# EAGLE design L293D_Driver (EAGLE 9.6.2)
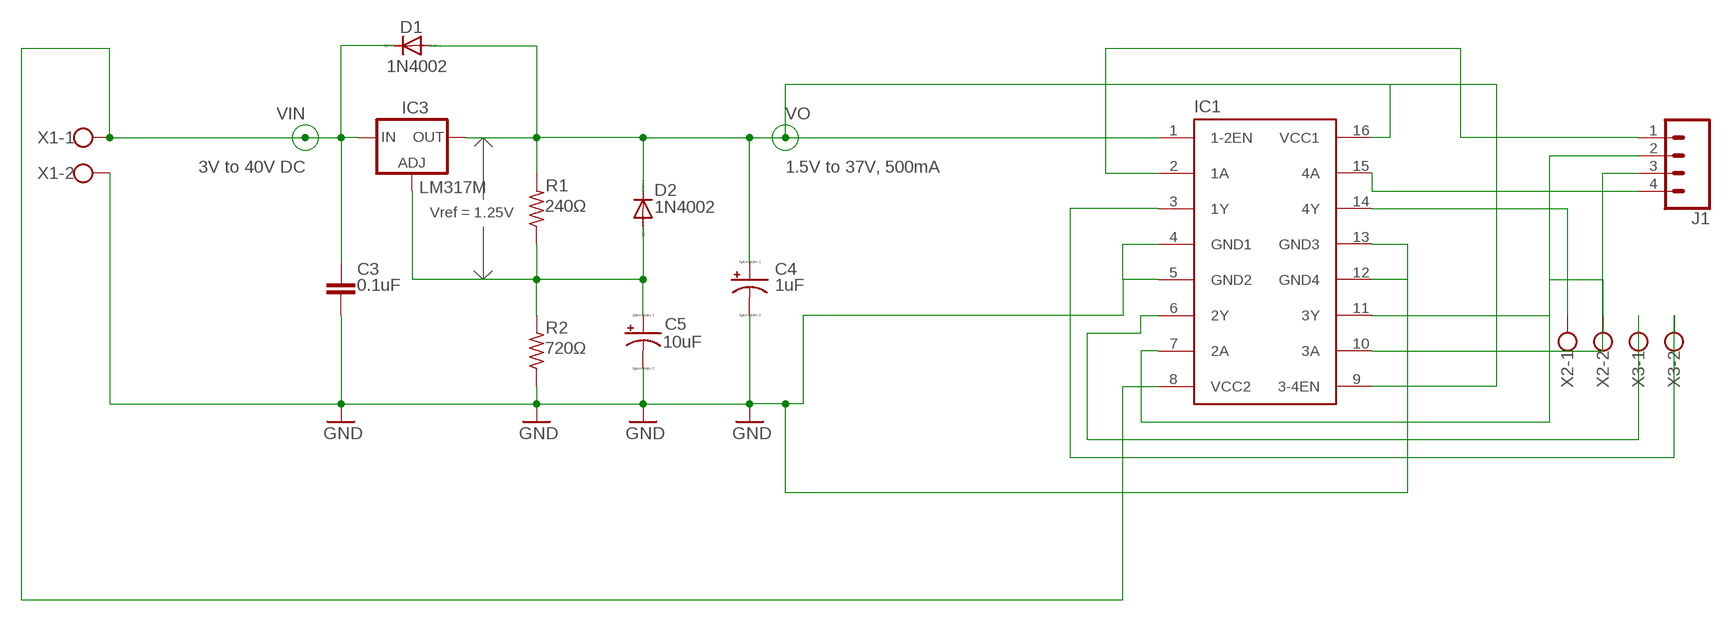
[diagram p0: schematic, sheet 1]

## Parts
C3  0.1uF  C-EU075-052X106  [C075-052X106]
C4  1uF  CPOL-US085CS-1AR  [085CS_1AR]
C5  10uF  CPOL-US085CS-1AR  [085CS_1AR]
D1  1N4002  1N4004  [DO41-10]
D2  1N4002  1N4004  [DO41-10]
IC1  L293D  [DIL16]
IC3  LM317MBSTT3  [SOT223]
J1  CONN_04PTH  [1X04]
R1  240Ω  R-US_M0805  [M0805]
R2  720Ω  R-US_M0805  [M0805]
X1  W237-102  [W237-102]
X2  W237-102  [W237-102]
X3  W237-102  [W237-102]

## Nets
GND: C3.2 C4.- C5.- IC1.4(GND1) IC1.5(GND2) IC1.12(GND4) IC1.13(GND3) R2.1 X1.2
N$1: C5.+ D2.A IC3.1(ADJ) R1.1 R2.2
N$2: IC1.15(4A) J1.4
N$3: IC1.10(3A) J1.3
N$4: IC1.14(4Y) X2.1
N$5: IC1.11(3Y) X2.2
N$6: IC1.3(1Y) X3.2
N$7: IC1.6(2Y) X3.1
N$8: IC1.7(2A) J1.2
N$9: IC1.2(1A) J1.1
VIN: C3.1 D1.C IC1.8(VCC2) IC3.3(IN) X1.1
VO: C4.+ D1.A D2.C IC1.1(1-2EN) IC1.9(3-4EN) IC1.16(VCC1) IC3.4(OUT) R1.2

## Notes on the sheet
- 3V to 40V DC | 1.5V to 37V, 500mA
- Vref = 1.25V

## Library data of the parts
C3 = rcl:C-EU: CAPACITOR, European symbol
C4 C5 = resistor:CPOL-US: POLARIZED CAPACITOR, American symbol
D1 D2 = diode:1N4004: DIODE general purpose rectifier, 1 A
IC1 = st-microelectronics:L293D: PUSH-PULL 4 CHANNEL DRIVER; MPN: L293D; OC_FARNELL: 9589619; OC_NEWARK: 56P8249
IC3 = v-reg:LM317?*: 500 mA Adjustable Output Positive Voltage Regulator Source: http://www.onsemi.co.jp .. LM317M-D.PDF; PARTNUMBER: LM317M
J1 = SparkFun-Connectors:CONN_04: Multi connection point. Often used as Generic Header-pin footprint for 0.1 inch spaced/style header connections On any of the 0.1 inch spaced packages, you can populate with these: Break Away Headers - Straight <https://www.sparkfun.com/products/116> (PRT-00116) Break Away Male Headers - Right Angle <https://www.sparkfun.com/products/553> (PRT-00553) Female Headers <https://www.sparkfun.com/products/115> (PRT-00115) Break Away Headers - Machine Pin <https://www.sparkfun.com/products/117> (PRT-00117) Break Away Female Headers - Swiss Machine Pin <https://www.sparkfun.com/products/743> (PRT-00743) For SCREWTERMINALS and SPRING TERMINALS visit here: Screw Terimnals on SparkFun.com <https://www.sparkfun.com/search/results?term=Screw+Terminals> (5mm/3.5mm/2.54mm spacing) This device is also useful as a general connection point to wire up your design to another part of your project. Our various solder wires solder well into these plated through hole pads. Hook-Up Wire - Assortment (Stranded, 22 AWG) <https://www.sparkfun.com/products/11375> (PRT-11375) Hook-Up Wire - Assortment (Solid Core, 22 AWG) <https://www.sparkfun.com/products/11367> (PRT-11367) View the entire wire category on our website here <https://www.sparkfun.com/categories/141> Special notes: Molex polarized connector foot print use with SKU : PRT-08231 with associated crimp pins and housings. 1MM SMD Version SKU: PRT-10208; PROD_ID: CONN-09696
R1 R2 = resistor:R-US_: RESISTOR, American symbol
X1-X3 = con-wago-500:W237-102: WAGO SCREW CLAMP; MPN: 237-102; OC_FARNELL: unknown; OC_NEWARK: 70K9898

## Board
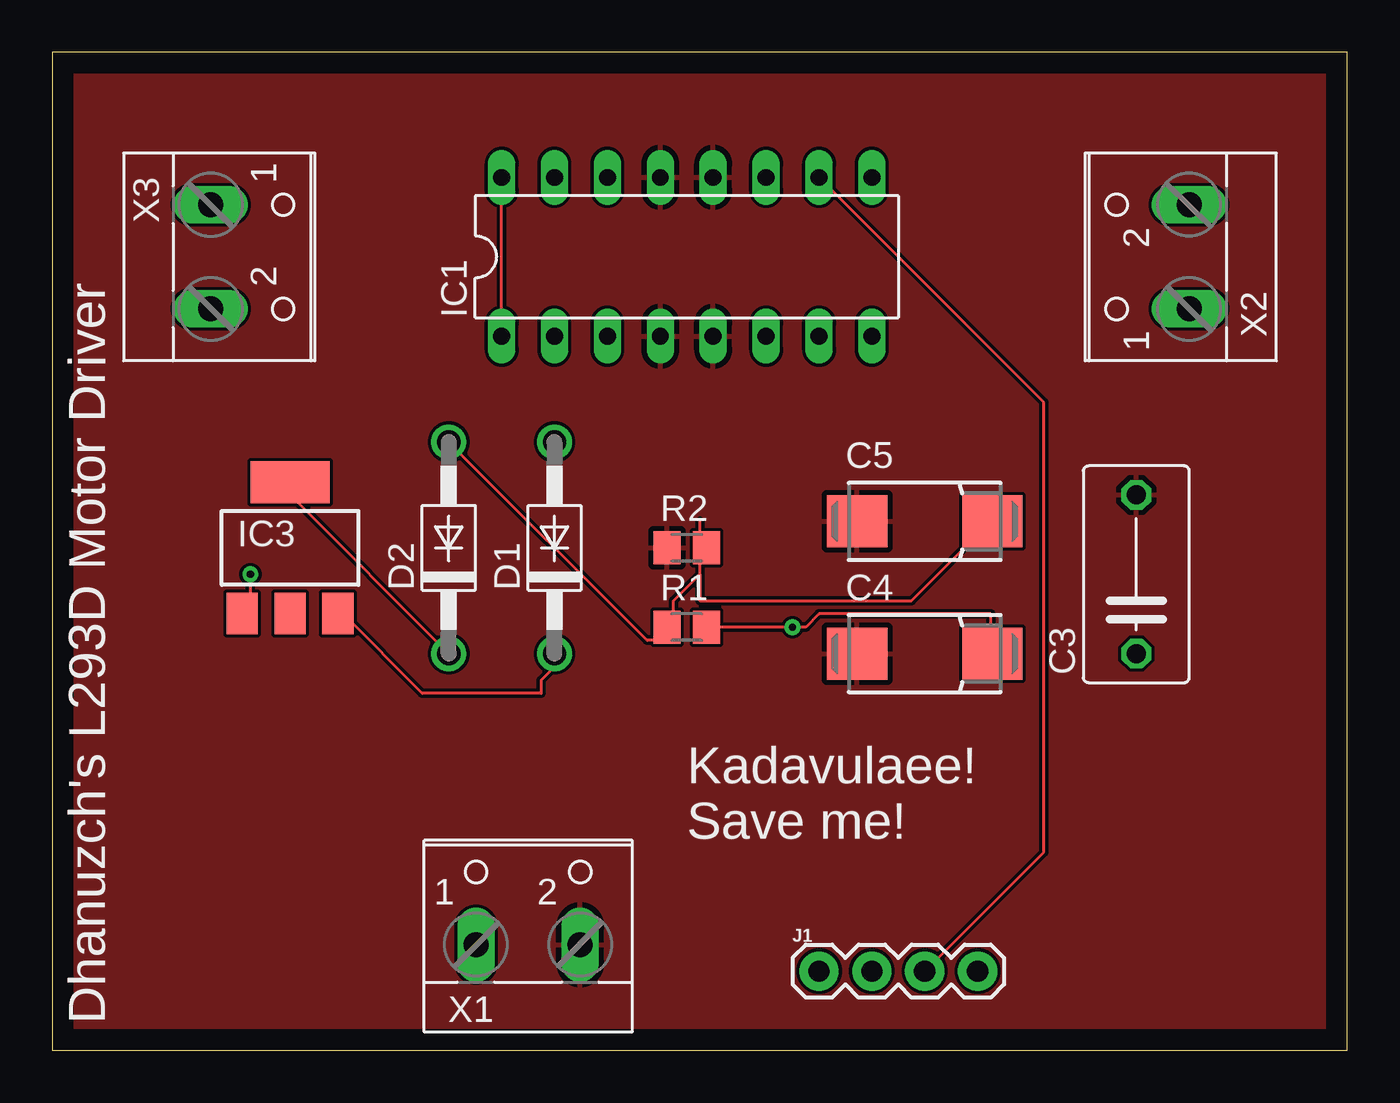
[diagram p1: board, top side]
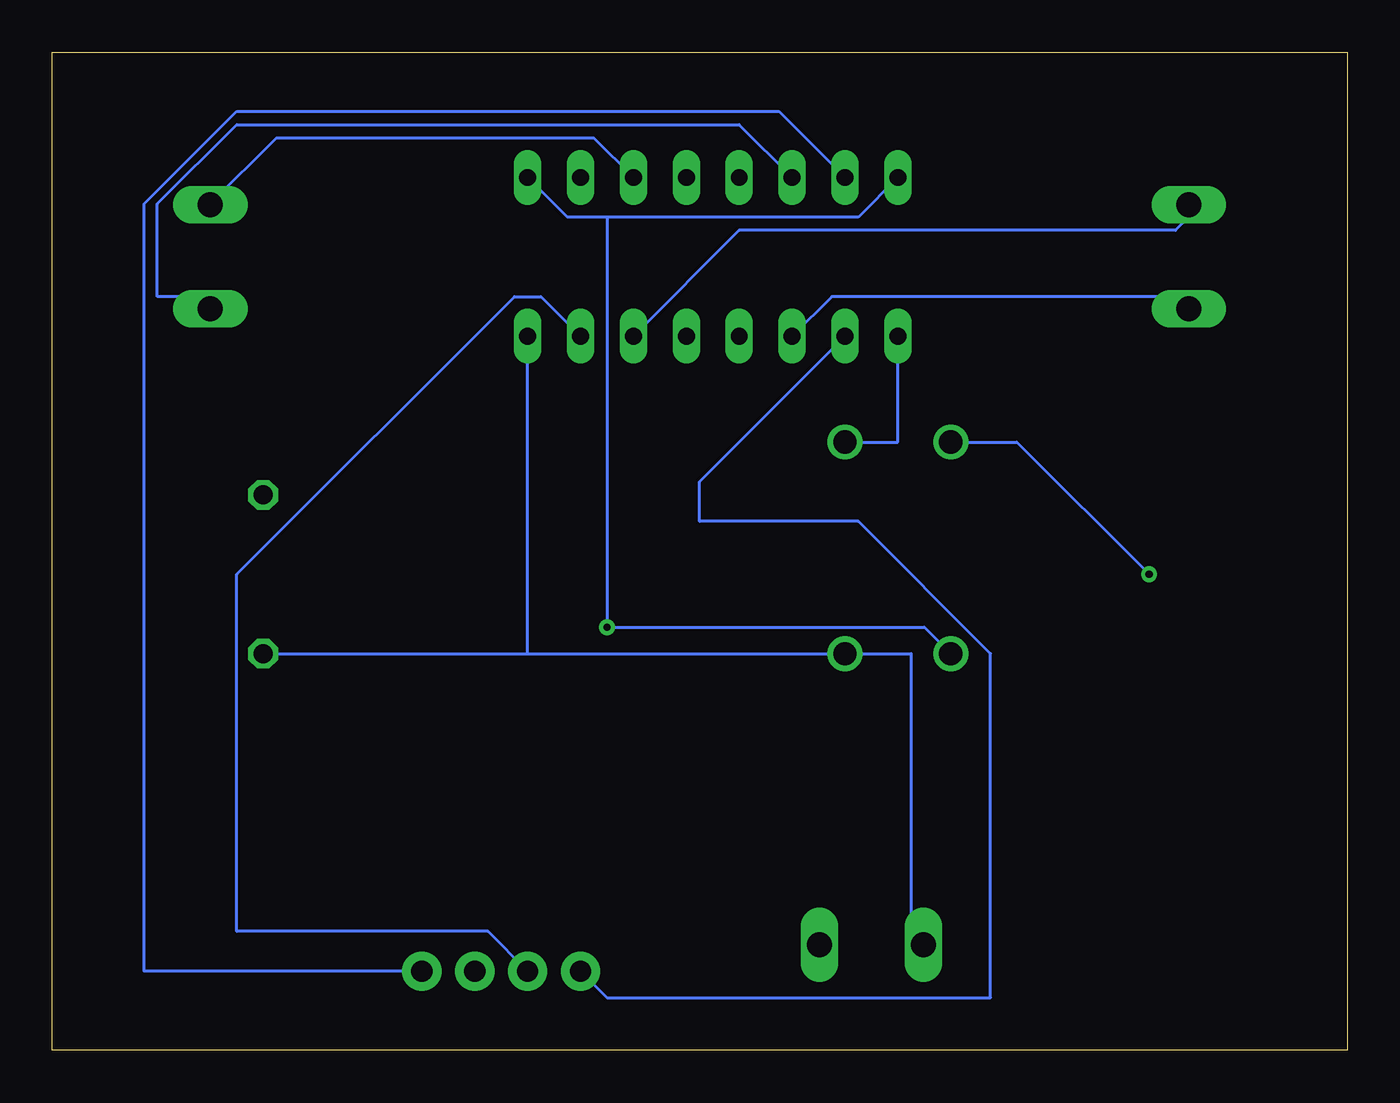
[diagram p2: board, bottom side, seen from below]

Size 62.21 x 47.93 mm. Coordinates in mm from the lower left corner, seen from the top.
Outline: 0,0 62.21,0 62.21,47.93 0,47.93 0,0
Copper layers (1*16): Top 0.035mm / dielectric 1.5mm / Bottom 0.035mm
Design rules "default": minimum track width 6mil, minimum drill 0.35mm, track to track 6mil, track to pad 6mil, pad to pad 6mil, via to via 6mil, smd to smd 6mil, copper to edge 40mil, drill to drill 6mil, minimum pad ring 10mil, minimum via ring 8mil, stop-mask expansion 4mil, vias tented up to drill 0mil, thermal gap 10mil

### Footprints (pad centres in the part's own frame; a part is rotated, then mirrored left to right if it is on the bottom)
C075-052X106 = drill 0.914 octagon: 1 -3.81,0; 2 3.81,0
085CS_1AR = smd 2.9 x 2.5: + 3.25,0; - -3.25,0
DO41-10 = drill 1.118: A 5.08,0; C -5.08,0
DIL16 = drill 0.813 long: 1 -8.89,-3.81; 2 -6.35,-3.81; 3 -3.81,-3.81; 4 -1.27,-3.81; 5 1.27,-3.81; 6 3.81,-3.81; 7 6.35,-3.81; 8 8.89,-3.81; 9 8.89,3.81; 10 6.35,3.81; 11 3.81,3.81; 12 1.27,3.81; 13 -1.27,3.81; 14 -3.81,3.81; 15 -6.35,3.81; 16 -8.89,3.81
SOT223 = smd 1.5 x 2: 1 -2.3,-3.15; 2 0,-3.15; 3 2.3,-3.15 | smd 3.8 x 2: 4 0,3.15
1X04 = drill 1.016 pad 1.88: 1 0,0; 2 2.54,0; 3 5.08,0; 4 7.62,0
M0805 = smd 1.3 x 1.6: 1 -0.95,0; 2 0.95,0
W237-102 = drill 1.194 long: 1 -2.5,-1.27; 2 2.5,-1.27

### Placement (x,y rotation side)
C3  52.07,22.86 90 top
C4  41.91,19.05 0 top
C5  41.91,25.4 0 top
D1  24.13,24.13 90 top
D2  19.05,24.13 90 top
IC1  30.48,38.1 0 top
IC3  11.43,24.13 0 top
J1  36.83,3.81 0 top
R1  30.48,20.32 0 top
R2  30.48,24.13 0 top
X1  22.86,6.35 0 top
X2  53.34,38.1 90 top
X3  8.89,38.1 270 top

### Tracks (layer width: path | path; a pad name or v marks a point on that pad's centre or on a via)
GND
  pour Top: 0,48.26 63.5,48.26 63.5,-1.27 0,-1.27 -1.27,-2.54 -1.27,48.26
N$1  (via drill 0.35)
  Top 0.152: v9.53,22.86 9.53,21.59 IC3.1 | 31.11,22.86 31.11,24.13 | 31.11,24.13 31.11,25.4 | 31.11,22.86 29.84,21.59 29.84,20.32 R1.1 29.21,20.32 29.21,19.68 28.57,19.68 D2.A | 31.11,22.86 31.11,21.59 41.27,21.59 45.09,25.4 C5.+ | 31.11,24.13 R2.2
  Bottom 0.152: v9.53,22.86 15.88,29.21 D2.A
N$2
  Bottom 0.152: IC1.15 27.3,45.09 53.34,45.09 57.78,40.64 57.78,3.81 J1.4
N$3
  Top 0.152: IC1.10 47.62,31.11 47.62,9.53 J1.3
N$4
  Bottom 0.152: IC1.14 29.21,44.45 53.34,44.45 57.15,40.64 57.15,36.2 54.61,36.2 X2.1
N$5
  Bottom 0.152: IC1.11 36.2,43.81 51.44,43.81 54.61,40.64 X2.2
N$6
  Bottom 0.152: IC1.3 24.77,36.2 7.62,36.2 X3.2
N$7
  Bottom 0.152: IC1.6 29.21,39.37 8.26,39.37 7.62,40.01 X3.1
N$8
  Bottom 0.152: IC1.7 38.73,36.2 40.01,36.2 53.34,22.86 53.34,5.71 41.27,5.71 J1.2
N$9
  Bottom 0.152: IC1.2 31.11,27.3 31.11,25.4 23.5,25.4 17.14,19.05 17.14,2.54 35.56,2.54 J1.1
VIN
  Top 0.152: D1.C 24.13,18.41 23.5,17.78 23.5,17.14 17.78,17.14 13.97,20.95 IC3.3
  Bottom 0.152: X1.1 20.95,5.08 20.95,19.05 D1.C 39.37,19.05 | 39.37,19.05 IC1.8 | C3.1 39.37,19.05
VO  (via drill 0.35)
  Top 0.152: D2.C 11.43,26.67 IC3.4 | R1.2 v35.56,20.32 36.2,20.32 36.83,20.95 45.09,20.95 45.09,19.05 C4.+ | IC1.1 IC1.16
  Bottom 0.152: IC1.1 21.59,29.21 D1.A | IC1.9 37.47,40.01 35.56,40.01 | 35.56,40.01 23.5,40.01 IC1.16 | 35.56,40.01 v35.56,20.32 20.32,20.32 D2.C

### Text on the board
tPlace: Kadavulaee! / Save me! | Dhanuzch's L293D Motor Driver